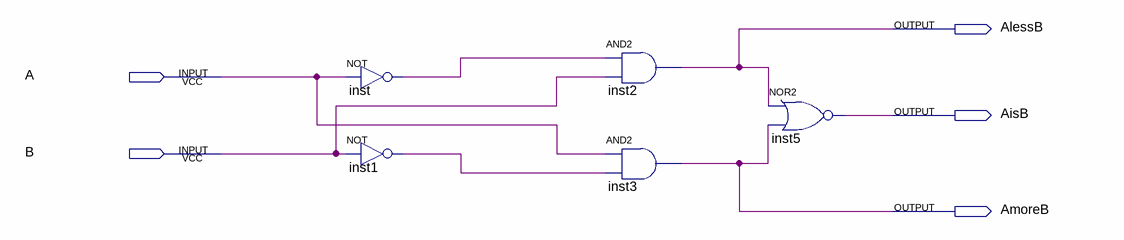
[diagram p0: schematic sheet]
// Quartus schematic compar.bdf as structural Verilog: 5 symbols, 5 pins
module compar (
  input  A,
  input  B,
  output AlessB,
  output AisB,
  output AmoreB
);

  wire inst1_out, inst_out;

  not inst (inst_out, A);
  not inst1 (inst1_out, B);
  and inst2 (AlessB, inst_out, B);
  and inst3 (AmoreB, A, inst1_out);
  nor inst5 (AisB, AlessB, AmoreB);
endmodule
